# Altium schematic sheet SDC-rev2.SchDoc
size B
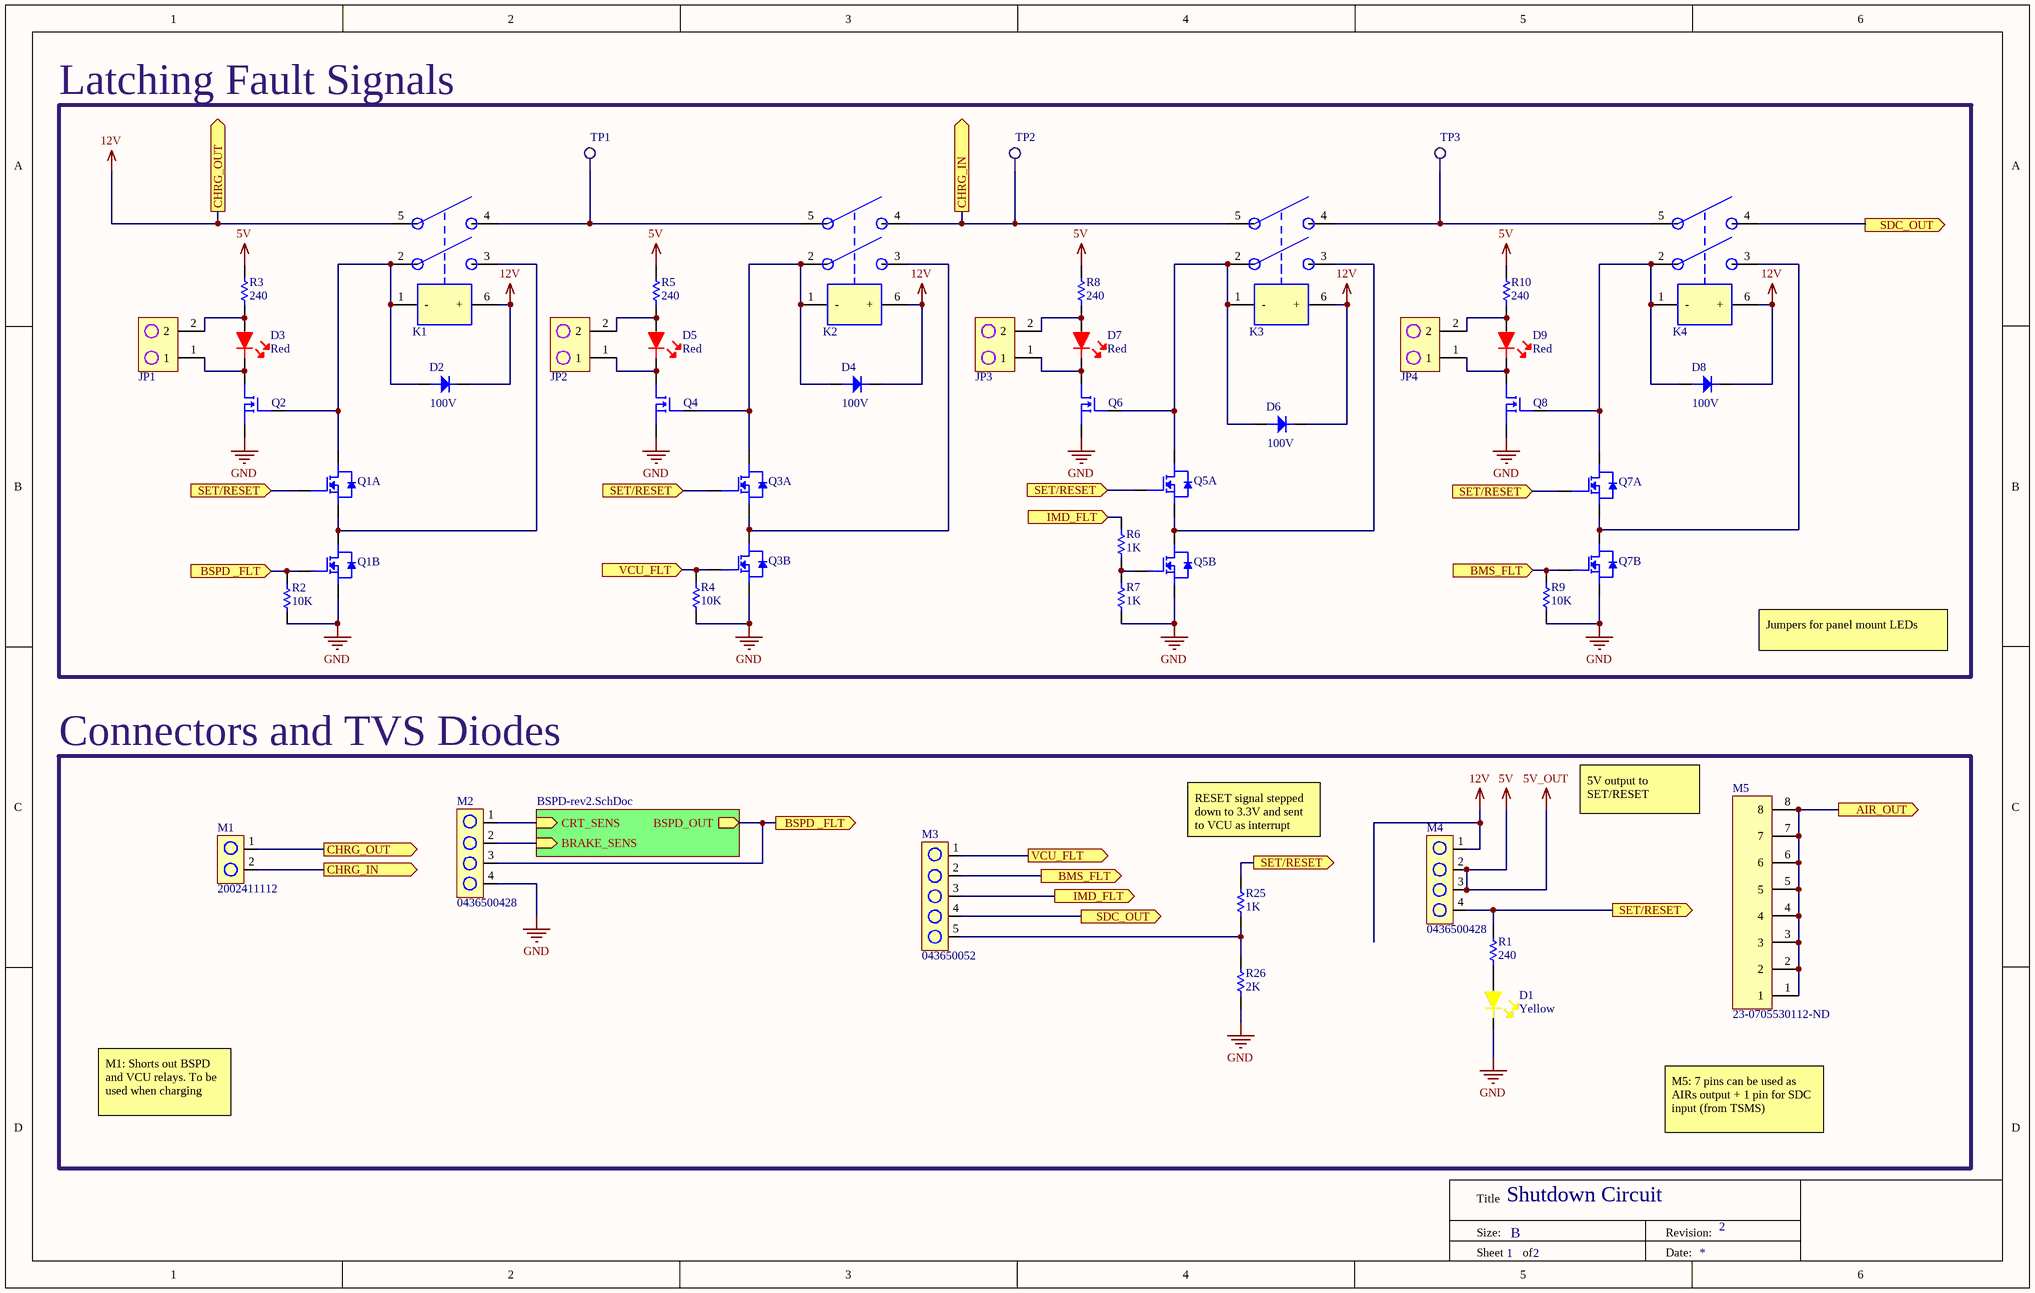
[diagram p0: SDC-rev2.SchDoc]

## Parts
D1  Yellow  [LED-0603]
D2  100V  [DO-214AA]
D3  Red  [LED-0603]
D4  100V  [DO-214AA]
D5  Red  [LED-0603]
D6  100V  [DO-214AA]
D7  Red  [LED-0603]
D8  100V  [DO-214AA]
D9  Red  [LED-0603]
JP1  732-5315-ND  [2PIN-JP]  (value not drawn)
JP2  732-5315-ND  [2PIN-JP]  (value not drawn)
JP3  732-5315-ND  [2PIN-JP]  (value not drawn)
JP4  732-5315-ND  [2PIN-JP]  (value not drawn)
K1  5-1419124-6  [RELAY DPST SDC]  (value not drawn)
K2  5-1419124-6  [RELAY DPST SDC]  (value not drawn)
K3  5-1419124-6  [RELAY DPST SDC]  (value not drawn)
K4  5-1419124-6  [RELAY DPST SDC]  (value not drawn)
M1  2002411112  [2-PIN MOLEX]
M2  0436500428  [4-PIN MOLEX]
M3  043650052  [5-PIN MOLEX]
M4  0436500428  [4-PIN MOLEX]
M5  23-0705530112-ND  [8PIN]
Q1  DMN63D1LDW  [DMN63D1LDW]  (value not drawn)  (parts A,B of 2)
Q2  DMN6140L-13DICT-ND  [SOT-23-3]  (value not drawn)
Q3  DMN63D1LDW  [DMN63D1LDW]  (value not drawn)  (parts A,B of 2)
Q4  DMN6140L-13DICT-ND  [SOT-23-3]  (value not drawn)
Q5  DMN63D1LDW  [DMN63D1LDW]  (value not drawn)  (parts A,B of 2)
Q6  DMN6140L-13DICT-ND  [SOT-23-3]  (value not drawn)
Q7  DMN63D1LDW  [DMN63D1LDW]  (value not drawn)  (parts A,B of 2)
Q8  DMN6140L-13DICT-ND  [SOT-23-3]  (value not drawn)
R1  240  [RES-0603]
R2  10K  [RES-0603]
R3  240  [RES-0603]
R4  10K  [RES-0603]
R5  240  [RES-0603]
R6  1K  [RES-0603]
R7  1K  [RES-0603]
R8  240  [RES-0603]
R9  10K  [RES-0603]
R10  240  [RES-0603]
R25  1K  [RES-0603]
R26  2K  [RES-0603]
TP1  Testpoint2  [TP2]  (value not drawn)
TP2  Testpoint2  [TP2]  (value not drawn)
TP3  Testpoint2  [TP2]  (value not drawn)

## Blocks framed on the sheet
Latching Fault Signals: D2-D9 JP1-JP4 K1-K4 Q1-Q8 R2-R10 TP1-TP3
Connectors and TVS Diodes: D1 M1-M5 R1 R25 R26

## Sub-sheets
U_BSPD-rev2 = BSPD-rev2.SchDoc: CRT_SENS (in), BRAKE_SENS (in), BSPD_OUT (out)

## Ports
AIR_OUT (out), BMS_FLT (in), BMS_FLT (out), BSPD _FLT (in), BSPD _FLT (out), CHRG_IN (out), CHRG_OUT (out), IMD_FLT (in), IMD_FLT (out), SDC_OUT (out), SET/RESET (in), SET/RESET (out), VCU_FLT (in), VCU_FLT (out)

## Nets
5V: M4.2 M4.3 R3.2 R5.2 R8.2 R10.2  [also labelled 5V_OUT]
12V: D2.1 D4.1 D6.1 D8.1 K1.5 K1.6(+) K2.6(+) K3.6(+) K4.6(+) M1.1 M4.1 ; port CHRG_OUT
GND: D1.2 M2.4 Q1.4(S2) Q2.3 Q3.4(S2) Q4.3 Q5.4(S2) Q6.3 Q7.4(S2) Q8.3 R2.2 R4.2 R7.2 R9.2 R26.1
AIR_OUT: M5.1 M5.2 M5.3 M5.4 M5.5 M5.6 M5.7 M5.8 ; port AIR_OUT
BMS_FLT: M3.2 Q7.5(G2) R9.1 ; port BMS_FLT
BSPD _FLT: M2.3 Q1.5(G2) R2.1 ; port BSPD _FLT, sheet U_BSPD-rev2/BSPD_OUT
CHRG_IN: K2.4 K3.5 M1.2 TP2.1 ; port CHRG_IN
IMD_FLT: M3.3 R6.1 ; port IMD_FLT
SDC_OUT: K4.4 M3.4 ; port SDC_OUT
SET/RESET: M4.4 Q1.2(G1) Q3.2(G1) Q5.2(G1) Q7.2(G1) R1.2 R25.2 ; port SET/RESET
VCU_FLT: M3.1 Q3.5(G2) R4.1 ; port VCU_FLT
NetD1_1: D1.1 R1.1
NetD2_2: D2.2 K1.1(-) K1.2 Q1.6(D1) Q2.1
NetD3_1: D3.1 JP1.2 R3.1
NetD3_2: D3.2 JP1.1 Q2.2
NetD4_2: D4.2 K2.1(-) K2.2 Q3.6(D1) Q4.1
NetD5_1: D5.1 JP2.2 R5.1
NetD5_2: D5.2 JP2.1 Q4.2
NetD6_2: D6.2 K3.1(-) K3.2 Q5.6(D1) Q6.1
NetD7_1: D7.1 JP3.2 R8.1
NetD7_2: D7.2 JP3.1 Q6.2
NetD8_2: D8.2 K4.1(-) K4.2 Q7.6(D1) Q8.1
NetD9_1: D9.1 JP4.2 R10.1
NetD9_2: D9.2 JP4.1 Q8.2
NetK1_3: K1.3 Q1.1(S1) Q1.3(D2)
NetK1_4: K1.4 K2.5 TP1.1
NetK2_3: K2.3 Q3.1(S1) Q3.3(D2)
NetK3_3: K3.3 Q5.1(S1) Q5.3(D2)
NetK3_4: K3.4 K4.5 TP3.1
NetK4_3: K4.3 Q7.1(S1) Q7.3(D2)
NetM2_1: M2.1 ; sheet U_BSPD-rev2/CRT_SENS
NetM2_2: M2.2 ; sheet U_BSPD-rev2/BRAKE_SENS
NetM3_5: M3.5 R25.1 R26.2
NetQ5_5: Q5.5(G2) R6.2 R7.1

## Notes on the sheet
- Jumpers for panel mount LEDs
- (near R25) RESET signal stepped down to 3.3V and sent to VCU as interrupt
- 5V output to SET/RESET
- M1: Shorts out BSPD and VCU relays. To be used when charging
- M5: 7 pins can be used as AIRs output + 1 pin for SDC input (from TSMS)
- Shutdown Circuit
- 2
- 1
- Title
- Size:
- B
- Revision:
- Sheet
- of
- Date:

## Library data of the parts
D1 = LED-Yellow: LED YELLOW CLEAR 0603 SMD; Manufacturer: Wurth Electronics; Manufacturer Part Number: 150060YS75000; Viewing Angle: 140°; Lens Style: Clear,Rectangular; Wavelength: 590nm; Luminous Intensity: 120mcd; Forward Voltage: 2V; Forward Current: 30mA; Test Current: 20mA; Supplier 1: Digi-Key; Stock 1: 78; Pricing 1: 1=0.14, 50=0.133, 100=0.114, 500=0.099 (USD); Mount: Surface Mount; Case/Package: 0603; Case Code (Metric): 1608; Case Code (Imperial): 0603; Color: Yellow; Min Operating Temperature: -40°C; Max Operating Temperature: 85°C; Package Quantity: 4000; Packaging: Tape and Reel; Dominant Wavelength: 590nm; Length: 1.6mm; Height: 0.7mm; Width: 0.8mm; REACH SVHC: Unknown; ComponentLink1URL: http://katalog.we-online.de/led/datasheet/150060YS75000.pdf?src-supplier=Newark; ComponentLink1Description: http://katalog.we-online.de/led/datasheet/150060YS75000.pdf?src-supplier=Newark; ComponentLink2URL: https://katalog.we-online.de/led/datasheet/150060YS75000.pdf?src-supplier=Digi-Key; ComponentLink2Description: https://katalog.we-online.de/led/datasheet/150060YS75000.pdf?src-supplier=Digi-Key; ComponentLink3URL: http://www.farnell.com/datasheets/1911348.pdf?src-supplier=Element14; ComponentLink3Description: http://www.farnell.com/datasheets/1911348.pdf?src-supplier=Element14; ComponentLink4URL: https://www.distrelec.biz/Web/Downloads/_t/ds/150060YS75000_eng_tds.pdf?mime=application%2Fpdf&src-supplier=Distrelec; ComponentLink4Description: https://www.distrelec.biz/Web/Downloads/_t/ds/150060YS75000_eng_tds.pdf?mime=application%2Fpdf&src-supplier=Distrelec; ComponentLink5URL: http://www.produktinfo.conrad.com/datenblaetter/750000-774999/759432-da-01-en-CHIPLED_0603_W_KL_GELB_150060YS75000.pdf?src-supplier=Conrad; ComponentLink5Description: http://www.produktinfo.conrad.com/datenblaetter/750000-774999/759432-da-01-en-CHIPLED_0603_W_KL_GELB_150060YS75000.pdf?src-supplier=Conrad; Supplier Part Number 1: 732-4981-6-ND
D2 D4 D6 D8 = Diode-600V-5A: DIODE GEN PURP 600V 5A SMB; Manufacturer: MCC; Manufacturer Part Number: SK510B-LTP; Mount: Surface Mount; Case/Package: SMB; Number of Pins: 2; Packaging: Tape and Reel; Average Rectified Current: 5A; Max Reverse Voltage (DC): 100V; ComponentLink1URL: http://components.arrow.com/part/dataview/49208388S301832N2022?src-supplier=Arrow; ComponentLink1Description: http://components.arrow.com/part/dataview/49208388S301832N2022?src-supplier=Arrow; ComponentLink2URL: http://www.mccsemi.com/up_pdf/SK52B-L-SK520B-L(DO-214AA).pdf?src-supplier=Digi-Key; ComponentLink2Description: http://www.mccsemi.com/up_pdf/SK52B-L-SK520B-L(DO-214AA).pdf?src-supplier=Digi-Key; Supplier 1: Digi-Key; Stock 1: 68219; Pricing 1: 1=0.4, 10=0.3, 25=0.2628, 100=0.1427, 250=0.14192, 500=0.11638, 1000=0.08634 (USD); ComponentLink3URL: http://www.smc-diodes.com/propdf/SD560B%20N1412%20REV.D.pdf?src-supplier=Digi-Key; ComponentLink3Description: http://www.smc-diodes.com/propdf/SD560B%20N1412%20REV.D.pdf?src-supplier=Digi-Key; Supplier Part Number 1: 1655-1530-6-ND
D3 D5 D7 D9 = LED-Red-Bright: LED RED CLEAR 0603 SMD; Manufacturer: Inolux; Manufacturer Part Number: IN-S63ATR; Lens Style: Flat; Luminous Intensity: 45mcd; Forward Voltage: 2.2V; Test Current: 20mA; Viewing Angle: 120°; Dominant Wavelength: 622nm; Lens Size: 0.8mm; Supplier 1: Digi-Key; Stock 1: 6977; Pricing 1: 1=0.33, 10=0.24, 100=0.1136, 500=0.07576, 1000=0.05934 (USD); Mount: Surface Mount; Case/Package: 0603; Color: Red; Lens Color: Clear; Case Code (Imperial): 0603; Case Code (Metric): 1608; Packaging: Cut Tape; Lens Transparency: Clear; Length: 1.6mm; Height: 0.4mm; Width: 0.8mm; ComponentLink1URL: http://www.inolux-corp.com/datasheet/SMDLED/Mono%20Color%20Top%20View/IN-S63AT%20Series_V1.1.pdf?src-supplier=Digi-Key; ComponentLink1Description: http://www.inolux-corp.com/datasheet/SMDLED/Mono%20Color%20Top%20View/IN-S63AT%20Series_V1.1.pdf?src-supplier=Digi-Key; Supplier Part Number 1: 1830-1065-6-ND
JP1-JP4 = 2PIN-TEST: CONN HEADER VERT 2POS 2.54MM
K1-K4 = 5-1419124-6: General Purpose Relay, Osa Series, Power, Non Latching, Dpst-No, 12 Vdc, 3 A Rohs Compliant: Yes; Manufacturer: TE Connectivity; Contact Current Rating: 3A; Coil Current: 45mA; Throw Configuration: DPST; Operate Time: 20ms; Release Time: 10ms; Coil Power: 600mW; Coil Resistance: 270R; Coil Type: Non-Latching; Coil Voltage (DC): 12V; Contact Voltage Rating (AC): 240V; Supplier 1: Digi-Key; Manufacturer Part Number: 5-1419124-6; Stock 1: 2593; Pricing 1: 1=2.54, 10=2.385, 25=2.1204, 50=2.0142, 100=1.9083, 250=1.69624, 500=1.59022, 1000=1.48421, 5000=1.4312 (USD); Mount: Through Hole; Weight: 13g; Contact Material: Silver; Min Operating Temperature: -30°C; Max Operating Temperature: 60°C; Package Quantity: 1000; Packaging: Box; Termination: PCB; Relay Type: General Purpose; Length: 24.4mm; Height: 0.976inch; Width: 12.9mm; ELV: Compliant; REACH SVHC: Unknown; ComponentLink1URL: http://www.farnell.com/datasheets/1652820.pdf?src-supplier=Farnell; ComponentLink1Description: http://www.farnell.com/datasheets/1652820.pdf?src-supplier=Farnell; ComponentLink2URL: http://www.farnell.com/cad/1652820.pdf?src-supplier=Element14; ComponentLink2Description: http://www.farnell.com/cad/1652820.pdf?src-supplier=Element14; ComponentLink3URL: http://www.te.com/commerce/DocumentDelivery/DDEController?Action=srchrtrv&DocNm=5-1419124-6&DocType=Customer+Drawing&DocLang=English&src-supplier=Digi-Key; ComponentLink3Description: http://www.te.com/commerce/DocumentDelivery/DDEController?Action=srchrtrv&DocNm=5-1419124-6&DocType=Customer+Drawing&DocLang=English&src-supplier=Digi-Key; Supplier Part Number 1: OSA-SS-212DM3,000-ND; Category: Relays
M1 = 2002411112: CONN HEADER VERT 2POS 5.7MM, 12-16AWG
M2 M4 = 0436500428: 4 PIN HDR, 3MM PITCH, 18-30 AWG; Manufacturer: Molex; Number of Positions: 4; Connector Type: Male Pin; Number of Ports: 1; Supplier 1: Digi-Key; Manufacturer Part Number: 0436500428; Stock 1: 1193; Pricing 1: 1=1.44, 10=1.265, 100=1.0916, 500=0.89316, 1000=0.79392, 5000=0.69468, 10000=0.65995 (USD); Mount: Through Hole; Contact Plating: Gold; Color: Black; Contact Material: Brass; Housing Material: Polymer; Number of Terminals: 4; Min Operating Temperature: -40°C; Max Operating Temperature: 105°C; Packaging: Tray; Number of Rows: 1; Termination: Solder; Fastening Type: Ramp; Number of Contacts: 4; Orientation: Straight; Package Quantity: 2040; Length: 15.65mm; Pitch: 3mm; Depth: 5.57mm; ComponentLink1URL: http://www.molex.com/pdm_docs/sd/436500428_sd.pdf?src-supplier=Digi-Key; ComponentLink1Description: http://www.molex.com/pdm_docs/sd/436500428_sd.pdf?src-supplier=Digi-Key; ComponentLink2URL: http://www.molex.com/webdocs/datasheets/pdf/en-us/0436500428_PCB_HEADERS.pdf?src-supplier=Avnet; ComponentLink2Description: http://www.molex.com/webdocs/datasheets/pdf/en-us/0436500428_PCB_HEADERS.pdf?src-supplier=Avnet; Supplier Part Number 1: WM10669-ND; Category: Connectors, Interconnects
M3 = 0436500528: CONN HEADER VERT 5POS 3MM
M5 = 8PIN: CONN HEADER R/A 8POS 2.54MM; Manufacturer: Molex; Manufacturer Part Number: 70553-0112; Contact Resistance: 30mR; Current Rating: 3A; Voltage Rating: 250V; Number of Positions: 8; Insulation Resistance: 1GR; Connector Type: Male Pin; Glow Wire Compliant: Non-compliant; Supplier 1: Digi-Key; Stock 1: 1363; Pricing 1: 1=2.43, 10=2.205, 100=1.89, 500=1.575, 1000=1.35, 5000=1.197, 10000=1.17 (USD); Mount: Through Hole; Color: Black; Contact Material: Bronze; Contact Plating: Gold; Material: Brass; Housing Material: Thermoplastic; Min Operating Temperature: -40°C; Max Operating Temperature: 105°C; Package Quantity: 1; Number of Rows: 1; Packaging: Rail/Tube; Termination: Solder; Number of Contacts: 8; Orientation: Right Angle; Voltage Rating (DC): 250V; Number of Circuits: 8; Pitch: 2.54mm; Contact Mating Length: 0.24inch; ELV: Compliant; Flammability Rating: UL94 V-0; ComponentLink1URL: https://www.molex.com/pdm_docs/ps/PS-70400.pdf?src-supplier=Digi-Key; ComponentLink1Description: https://www.molex.com/pdm_docs/ps/PS-70400.pdf?src-supplier=Digi-Key; ComponentLink2URL: http://www.mouser.com/ds/2/276/0705530112_PCB_HEADERS-172840.pdf?src-supplier=Mouser; ComponentLink2Description: http://www.mouser.com/ds/2/276/0705530112_PCB_HEADERS-172840.pdf?src-supplier=Mouser; Supplier Part Number 1: 23-0705530112-ND
Q1 Q3 Q5 Q7 = DMN63D1LDW: MOSFET 2N-CH 60V 0.25A SOT363; Manufacturer: Toshiba; Manufacturer Part Number: SSM6N7002CFU,LF; Continuous Drain Current (ID): 170mA; Rds On Max: 3.9R; Input Capacitance: 17pF; Max Power Dissipation: 285mW; FET Type: 2 N-Channel; Supplier 1: Digi-Key; Stock 1: 13946; Pricing 1: 1=0.27, 10=0.221, 100=0.0906, 500=0.0756, 1000=0.05253 (USD); Mount: Surface Mount; Case/Package: SOT-363; Packaging: Tape and Reel; Drain to Source Voltage (Vdss): 60V; ComponentLink1URL: https://toshiba.semicon-storage.com/info/docget.jsp?did=29875&prodName=SSM6N7002CFU&src-supplier=Digi-Key; ComponentLink1Description: https://toshiba.semicon-storage.com/info/docget.jsp?did=29875&prodName=SSM6N7002CFU&src-supplier=Digi-Key; ComponentLink2URL: http://www.mouser.com/ds/2/408/SSM6N7002CFU_datasheet_en_20150413-736631.pdf?src-supplier=Mouser; ComponentLink2Description: http://www.mouser.com/ds/2/408/SSM6N7002CFU_datasheet_en_20150413-736631.pdf?src-supplier=Mouser; Category: Discrete Semiconductor Products; Supplier Part Number 1: SSM6N7002CFULFDKR-ND
Q2 Q4 Q6 Q8 = N-FET-60V-1.6A: MOSFET N-CH 60V 1.6A SOT23; Manufacturer: Diodes; Rds On Max: 140mR; Input Capacitance: 315pF; Max Power Dissipation: 700mW; Supplier 1: Digi-Key; Manufacturer Part Number: DMN6140L-13; Stock 1: 274948; Pricing 1: 1=0.34, 10=0.256, 25=0.224, 100=0.1217, 250=0.12104, 500=0.09926, 1000=0.07365, 2500=0.06468, 5000=0.05924 (USD); Mount: Surface Mount; Case/Package: TO-236-3; Min Operating Temperature: -55°C; Max Operating Temperature: 150°C; Package Quantity: 10000; Packaging: Cut Tape; Drain to Source Voltage (Vdss): 60V; Continuous Drain Current (ID): 1.6A; ComponentLink1URL: https://www.diodes.com/assets/Datasheets/DMN6140L.pdf?src-supplier=Digi-Key; ComponentLink1Description: https://www.diodes.com/assets/Datasheets/DMN6140L.pdf?src-supplier=Digi-Key; Supplier Part Number 1: DMN6140L-13DIDKR-ND
R1 R3 R5 R8 R10 R25 = ESR03EZPJ241: RES SMD 240 OHM 5% 1/4W 0603; Manufacturer: Vishay; Manufacturer Part Number: CRCW0603220RJNEA; Resistance: 220R; Power Rating: 100mW; Voltage Rating: 75V; Temperature Coefficient: 200ppm/°C; Supplier 1: Digi-Key; Stock 1: 171552; Pricing 1: 1=0.1, 10=0.031, 100=0.0125, 1000=0.00562, 2500=0.00488 (USD); Mount: Surface Mount; Case/Package: 0603; Weight: 7.1E-05oz; Case Code (Metric): 1608; Case Code (Imperial): 0603; Contact Plating: Tin; Min Operating Temperature: -55°C; Max Operating Temperature: 155°C; Tolerance: 5%; Packaging: Tape and Reel; Package Quantity: 1; Composition: Thick Film; Number of Terminations: 2; Military Standard: Not; Termination: SMD/SMT; Max Power Dissipation: 100mW; Working Voltage: 75V; Features: Automotive AEC-Q200; Length: 1.55mm; Height: 0.45mm; Width: 0.033inch; Depth: 0.85mm; Radiation Hardening: No; REACH SVHC: Unknown; ComponentLink1URL: http://www.vishay.com/docs/20035/dcrcwe3.pdf?src-supplier=Digi-Key; ComponentLink1Description: http://www.vishay.com/docs/20035/dcrcwe3.pdf?src-supplier=Digi-Key; ComponentLink2URL: http://www.vishay.com/docs/20035/dcrcwe3.pdf?src-supplier=Avnet; ComponentLink2Description: http://www.vishay.com/docs/20035/dcrcwe3.pdf?src-supplier=Avnet; ComponentLink3URL: http://www.alliedelec.com/m/d/0c934d6939ccefa68dbe0b96d821c8cf.pdf?src-supplier=Allied+Electronics; ComponentLink3Description: http://www.alliedelec.com/m/d/0c934d6939ccefa68dbe0b96d821c8cf.pdf?src-supplier=Allied+Electronics; ComponentLink4URL: http://www.farnell.com/datasheets/2045673.pdf?src-supplier=Element14; ComponentLink4Description: http://www.farnell.com/datasheets/2045673.pdf?src-supplier=Element14; ComponentLink5URL: http://www.mouser.com/ds/2/427/dcrcwe3-109170.pdf?src-supplier=Mouser; ComponentLink5Description: http://www.mouser.com/ds/2/427/dcrcwe3-109170.pdf?src-supplier=Mouser; Supplier Part Number 1: 541-220GCT-ND; Category: Resistors
R2 R4 R9 = CRCW060310K0FKEA: RES SMD 10K OHM 1% 1/10W 0603; Manufacturer: Vishay; Resistance: 10kR; Temperature Coefficient: 100ppm/°C; Power Rating: 100mW; Voltage Rating: 75V; Supplier 1: Digi-Key; Manufacturer Part Number: CRCW060310K0FKEA; Stock 1: 1434373; Pricing 1: 1=0.1, 10=0.034, 100=0.0139, 1000=0.00623, 2500=0.0054 (USD); Case/Package: 0603; Number of Pins: 2; Weight: 7.1E-05oz; Contact Plating: Tin,Lead; Case Code (Metric): 1608; Case Code (Imperial): 0603; Min Operating Temperature: -55°C; Max Operating Temperature: 155°C; Tolerance: 1%; Composition: Thick Film; Packaging: Tape and Reel; Package Quantity: 10; Number of Terminations: 2; Military Standard: Not; Termination: SMD/SMT; Max Power Dissipation: 100mW; Voltage Rating (DC): 75V; Features: Automotive AEC-Q200; Length: 1.55mm; Height: 0.45mm; Width: 0.033inch; Depth: 0.85mm; Radiation Hardening: No; Lead Free: Lead Free; REACH SVHC: Unknown; ComponentLink1URL: http://www.vishay.com/docs/20008/dcrcw.pdf?src-supplier=Avnet+Europe; ComponentLink1Description: http://www.vishay.com/docs/20008/dcrcw.pdf?src-supplier=Avnet+Europe; ComponentLink2URL: https://www.verical.com/server-webapp/html/getDatasheet?partID=86831&src-supplier=Verical; ComponentLink2Description: https://www.verical.com/server-webapp/html/getDatasheet?partID=86831&src-supplier=Verical; ComponentLink3URL: http://www.farnell.com/datasheets/2310790.pdf?src-supplier=Allied+Electronics; ComponentLink3Description: http://www.farnell.com/datasheets/2310790.pdf?src-supplier=Allied+Electronics; ComponentLink4URL: http://www.vishay.com/docs/20035/dcrcwe3.pdf?src-supplier=Digi-Key; ComponentLink4Description: http://www.vishay.com/docs/20035/dcrcwe3.pdf?src-supplier=Digi-Key; ComponentLink5URL: http://www.farnell.com/datasheets/2310790.pdf?src-supplier=Mouser; ComponentLink5Description: http://www.farnell.com/datasheets/2310790.pdf?src-supplier=Mouser; ComponentLink6URL: http://www.farnell.com/datasheets/2310790.pdf?src-supplier=Element14; ComponentLink6Description: http://www.farnell.com/datasheets/2310790.pdf?src-supplier=Element14; ComponentLink7URL: http://www.farnell.com/datasheets/2310790.pdf?src-supplier=Avnet; ComponentLink7Description: http://www.farnell.com/datasheets/2310790.pdf?src-supplier=Avnet; ComponentLink8URL: http://www.vishay.com/docs/20035/dcrcwe3.pdf?src-supplier=Future+Electronics; ComponentLink8Description: http://www.vishay.com/docs/20035/dcrcwe3.pdf?src-supplier=Future+Electronics; ComponentLink9URL: http://uk.rs-online.com/webdocs/0d98/0900766b80d98afc.pdf?src-supplier=RSComponents; ComponentLink9Description: http://uk.rs-online.com/webdocs/0d98/0900766b80d98afc.pdf?src-supplier=RSComponents; ComponentLink10URL: http://www.farnell.com/datasheets/2310790.pdf?src-supplier=Distrelec; ComponentLink10Description: http://www.farnell.com/datasheets/2310790.pdf?src-supplier=Distrelec; Supplier Part Number 1: 541-10.0KHCT-ND; Category: Resistors
R6 R7 = CRCW06031K00FKEA: RES SMD 1K OHM 1% 1/10W 0603; Manufacturer: Vishay Dale; Resistance: 1kR; Temperature Coefficient: 100ppm/°C; Power Rating: 100mW; Voltage Rating: 75V; Supplier 1: Digi-Key; Manufacturer Part Number: CRCW06031K00FKEA; Stock 1: 1811474; Pricing 1: 1=0.1, 10=0.034, 100=0.0139, 1000=0.00623, 2500=0.0054 (USD); Mount: Surface Mount; Case/Package: 0603; Number of Pins: 2; Weight: 7.1E-05oz; Contact Plating: Tin; Case Code (Metric): 1608; Case Code (Imperial): 0603; Min Operating Temperature: -55°C; Max Operating Temperature: 155°C; Composition: Thick Film; Tolerance: 1%; Termination: SMD/SMT; Packaging: Tape and Reel; Package Quantity: 10; Number of Terminations: 2; Military Standard: Not; Max Power Dissipation: 100mW; Voltage Rating (DC): 75V; Features: Automotive AEC-Q200; Length: 1.55mm; Height: 0.45mm; Width: 0.033inch; Depth: 0.85mm; Radiation Hardening: No; Lead Free: Lead Free; REACH SVHC: Unknown; ComponentLink1URL: http://www.vishay.com/docs/20035/dcrcwe3.pdf?src-supplier=Digi-Key; ComponentLink1Description: http://www.vishay.com/docs/20035/dcrcwe3.pdf?src-supplier=Digi-Key; ComponentLink2URL: http://uk.rs-online.com/webdocs/0d98/0900766b80d98afc.pdf?src-supplier=RSComponents; ComponentLink2Description: http://uk.rs-online.com/webdocs/0d98/0900766b80d98afc.pdf?src-supplier=RSComponents; ComponentLink3URL: http://www.vishay.com/docs/20035/dcrcwe3.pdf?src-supplier=Avnet; ComponentLink3Description: http://www.vishay.com/docs/20035/dcrcwe3.pdf?src-supplier=Avnet; ComponentLink4URL: http://www.vishay.com/docs/20035/dcrcwe3.pdf?src-supplier=Avnet+Asia; ComponentLink4Description: http://www.vishay.com/docs/20035/dcrcwe3.pdf?src-supplier=Avnet+Asia; ComponentLink5URL: http://www.farnell.com/datasheets/2310790.pdf?src-supplier=Element14; ComponentLink5Description: http://www.farnell.com/datasheets/2310790.pdf?src-supplier=Element14; ComponentLink6URL: https://www.distrelec.biz/Web/Downloads/a_/en/flD-CRCW-e3_data_en.pdf?mime=application%2Fpdf&src-supplier=Distrelec; ComponentLink6Description: https://www.distrelec.biz/Web/Downloads/a_/en/flD-CRCW-e3_data_en.pdf?mime=application%2Fpdf&src-supplier=Distrelec; ComponentLink7URL: http://www.vishay.com/docs/20035/dcrcwe3.pdf?src-supplier=Future+Electronics; ComponentLink7Description: http://www.vishay.com/docs/20035/dcrcwe3.pdf?src-supplier=Future+Electronics; ComponentLink8URL: http://www.vishay.com/docs/20035/dcrcwe3.pdf?src-supplier=Avnet+Europe; ComponentLink8Description: http://www.vishay.com/docs/20035/dcrcwe3.pdf?src-supplier=Avnet+Europe; Supplier Part Number 1: 541-1.00KHCT-ND; Category: Resistors
R26 = ERA-3AEB202V: RES SMD 2K OHM 0.1% 1/10W 0603; Manufacturer: Vishay Dale; Manufacturer Part Number: CRCW06031K00FKEA; Resistance: 1kR; Tolerance: 1%; Temperature Coefficient: 100ppm/°C; Power Rating: 100mW; Voltage Rating: 75V; Supplier 1: Digi-Key; Stock 1: 1811474; Pricing 1: 1=0.1, 10=0.034, 100=0.0139, 1000=0.00623, 2500=0.0054 (USD); Mount: Surface Mount; Case/Package: 0603; Number of Pins: 2; Weight: 7.1E-05oz; Contact Plating: Tin; Case Code (Metric): 1608; Case Code (Imperial): 0603; Min Operating Temperature: -55°C; Max Operating Temperature: 155°C; Composition: Thick Film; Termination: SMD/SMT; Packaging: Tape and Reel; Package Quantity: 10; Number of Terminations: 2; Military Standard: Not; Max Power Dissipation: 100mW; Voltage Rating (DC): 75V; Features: Automotive AEC-Q200; Length: 1.55mm; Height: 0.45mm; Width: 0.033inch; Depth: 0.85mm; Radiation Hardening: No; Lead Free: Lead Free; REACH SVHC: Unknown; ComponentLink1URL: http://www.vishay.com/docs/20035/dcrcwe3.pdf?src-supplier=Digi-Key; ComponentLink1Description: http://www.vishay.com/docs/20035/dcrcwe3.pdf?src-supplier=Digi-Key; ComponentLink2URL: http://uk.rs-online.com/webdocs/0d98/0900766b80d98afc.pdf?src-supplier=RSComponents; ComponentLink2Description: http://uk.rs-online.com/webdocs/0d98/0900766b80d98afc.pdf?src-supplier=RSComponents; ComponentLink3URL: http://www.vishay.com/docs/20035/dcrcwe3.pdf?src-supplier=Avnet; ComponentLink3Description: http://www.vishay.com/docs/20035/dcrcwe3.pdf?src-supplier=Avnet; ComponentLink4URL: http://www.vishay.com/docs/20035/dcrcwe3.pdf?src-supplier=Avnet+Asia; ComponentLink4Description: http://www.vishay.com/docs/20035/dcrcwe3.pdf?src-supplier=Avnet+Asia; ComponentLink5URL: http://www.farnell.com/datasheets/2310790.pdf?src-supplier=Element14; ComponentLink5Description: http://www.farnell.com/datasheets/2310790.pdf?src-supplier=Element14; ComponentLink6URL: https://www.distrelec.biz/Web/Downloads/a_/en/flD-CRCW-e3_data_en.pdf?mime=application%2Fpdf&src-supplier=Distrelec; ComponentLink6Description: https://www.distrelec.biz/Web/Downloads/a_/en/flD-CRCW-e3_data_en.pdf?mime=application%2Fpdf&src-supplier=Distrelec; ComponentLink7URL: http://www.vishay.com/docs/20035/dcrcwe3.pdf?src-supplier=Future+Electronics; ComponentLink7Description: http://www.vishay.com/docs/20035/dcrcwe3.pdf?src-supplier=Future+Electronics; ComponentLink8URL: http://www.vishay.com/docs/20035/dcrcwe3.pdf?src-supplier=Avnet+Europe; ComponentLink8Description: http://www.vishay.com/docs/20035/dcrcwe3.pdf?src-supplier=Avnet+Europe; Supplier Part Number 1: 541-1.00KHCT-ND; Category: Resistors
TP1-TP3 = Testpoint2: Single layer pad TP